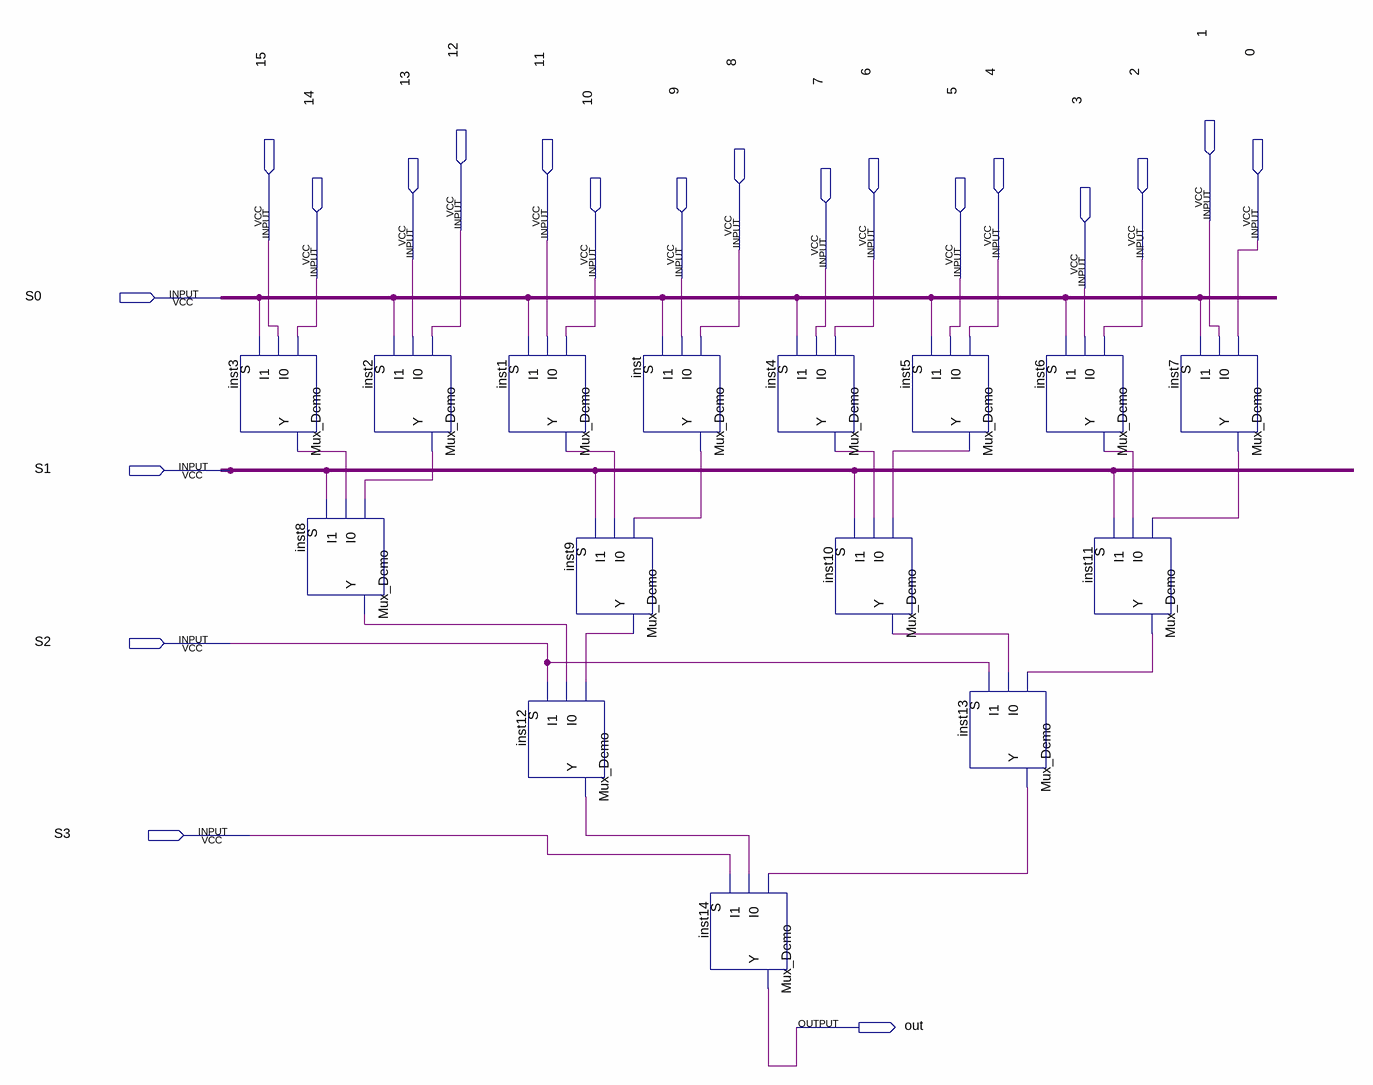
[diagram p0: schematic sheet]
// Quartus schematic 16_4.bdf as structural Verilog: 15 symbols, 21 pins
module \16_4  (
  input  \1 ,
  input  \12 ,
  input  \15 ,
  input  \11 ,
  input  \0 ,
  input  \8 ,
  input  \13 ,
  input  \6 ,
  input  \4 ,
  input  \2 ,
  input  \7 ,
  input  \14 ,
  input  \10 ,
  input  \9 ,
  input  \5 ,
  input  \3 ,
  input  S0,
  input  S1,
  input  S2,
  input  S3,
  output out
);

  wire inst1_y, inst2_y, inst3_y, inst4_y, inst5_y, inst6_y, inst7_y, inst8_y, inst9_y, inst10_y, inst11_y,
       inst12_y, inst13_y, inst_y;

  Mux_Demo inst3 (.I0(\14 ), .I1(\15 ), .S(S0), .Y(inst3_y));
  Mux_Demo inst8 (.I0(inst2_y), .I1(inst3_y), .S(S1), .Y(inst8_y));
  Mux_Demo inst2 (.I0(\12 ), .I1(\13 ), .S(S0), .Y(inst2_y));
  Mux_Demo inst1 (.I0(\10 ), .I1(\11 ), .S(S0), .Y(inst1_y));
  Mux_Demo inst9 (.I0(inst_y), .I1(inst1_y), .S(S1), .Y(inst9_y));
  Mux_Demo inst12 (.I0(inst9_y), .I1(inst8_y), .S(S2), .Y(inst12_y));
  Mux_Demo inst (.I0(\8 ), .I1(\9 ), .S(S0), .Y(inst_y));
  Mux_Demo inst14 (.I0(inst13_y), .I1(inst12_y), .S(S3), .Y(out));
  Mux_Demo inst4 (.I0(\6 ), .I1(\7 ), .S(S0), .Y(inst4_y));
  Mux_Demo inst10 (.I0(inst5_y), .I1(inst4_y), .S(S1), .Y(inst10_y));
  Mux_Demo inst5 (.I0(\4 ), .I1(\5 ), .S(S0), .Y(inst5_y));
  Mux_Demo inst13 (.I0(inst11_y), .I1(inst10_y), .S(S2), .Y(inst13_y));
  Mux_Demo inst6 (.I0(\2 ), .I1(\3 ), .S(S0), .Y(inst6_y));
  Mux_Demo inst11 (.I0(inst7_y), .I1(inst6_y), .S(S1), .Y(inst11_y));
  Mux_Demo inst7 (.I0(\0 ), .I1(\1 ), .S(S0), .Y(inst7_y));
endmodule
